# Altium schematic sheet SHEET1.SCHDOC
size A4
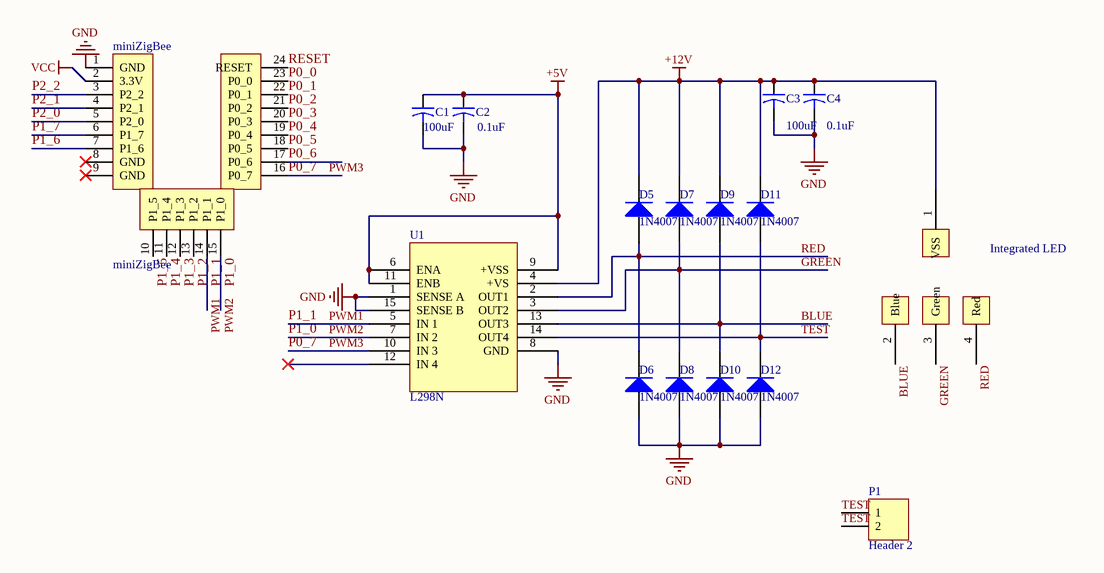
[diagram p0: SHEET1.SCHDOC]

## Parts
C1  value 100uF  [CAPR5-4X5]
C2  value 0.1uF  [CAPR5-4X5]
C3  value 100uF  [CAPR5-4X5]
C4  value 0.1uF  [CAPR5-4X5]
D5  1N4007  [DO-41]
D6  1N4007  [DO-41]
D7  1N4007  [DO-41]
D8  1N4007  [DO-41]
D9  1N4007  [DO-41]
D10  1N4007  [DO-41]
D11  1N4007  [DO-41]
D12  1N4007  [DO-41]
Integrated_LED  Integrated LED  [Integrated LED]  (value not drawn)
miniZigBee  miniZigBee  [miniZigBee]
P1  Header 2  [HDR1X2]
U1  L298N  [L298N - duplicate]

## Nets
+5V: C1.1 C2.1 U1.6(ENA) U1.9(+VSS) U1.11(ENB)
+12V: C3.1 C4.1 D5.2(K) D7.2(K) D9.2(K) D11.2(K) Integrated_LED.1(VSS) U1.4(+VS)
GND: C1.2 C2.2 C3.2 C4.2 D6.1(A) D8.1(A) D10.1(A) D12.1(A) miniZigBee.1(GND) U1.1(SENSE_A) U1.8(GND) U1.15(SENSE_B)
VCC: miniZigBee.2(3.3V)
BLUE: D9.1(A) D10.2(K) Integrated_LED.2(Blue) U1.13(OUT3)
GREEN: D7.1(A) D8.2(K) Integrated_LED.3(Green) U1.3(OUT2)
P0_0: miniZigBee.23(P0_0)
P0_1: miniZigBee.22(P0_1)
P0_2: miniZigBee.21(P0_2)
P0_3: miniZigBee.20(P0_3)
P0_4: miniZigBee.19(P0_4)
P0_5: miniZigBee.18(P0_5)
P0_6: miniZigBee.17(P0_6)
P0_7: miniZigBee.16(P0_7) U1.10(IN_3)  [also labelled PWM3]
P1_0: miniZigBee.15(P1_0) U1.7(IN_2)  [also labelled PWM2]
P1_1: miniZigBee.14(P1_1) U1.5(IN_1)  [also labelled PWM1]
P1_2: miniZigBee.13(P1_2)
P1_3: miniZigBee.12(P1_3)
P1_4: miniZigBee.11(P1_4)
P1_5: miniZigBee.10(P1_5)
P1_6: miniZigBee.7(P1_6)
P1_7: miniZigBee.6(P1_7)
P2_0: miniZigBee.5(P2_0)
P2_1: miniZigBee.4(P2_1)
P2_2: miniZigBee.3(P2_2)
RED: D5.1(A) D6.2(K) Integrated_LED.4(Red) U1.2(OUT1)
RESET: miniZigBee.24(RESET)
TEST: D11.1(A) D12.2(K) P1.1 P1.2 U1.14(OUT4)

Not connected (* = marked no-connect by the designer): miniZigBee 8(GND)* 9(GND)*; U1 12(IN_4)*

## Library data of the parts
C1-C4 = Cap2: Capacitor; Published: 23-Sep-2002; PackageReference: CAPR5-4X5; Publisher: Altium Limited
D5-D12 = Diode 1N4007: 1 Amp General Purpose Rectifier; Published: 8-Jun-2000; LatestRevisionDate: 17-Jul-2002; LatestRevisionNote: Re-released for DXP Platform.; DatasheetDocument: 1998; PackageDocument: Aug-1999; PackageReference: DO-41; Publisher: Altium Limited; Code_JEDEC: DO-204-AL; ComponentLink1Description: Manufacturer Link; ComponentLink1URL: http://www.fairchildsemi.com/; ComponentLink2Description: Datasheet; ComponentLink2URL: http://www.fairchildsemi.com/ds/1N%2F1N4001.pdf
P1 = Header 2: Header, 2-Pin; LatestRevisionDate: 17-Jul-2002; LatestRevisionNote: Re-released for DXP Platform.; Publisher: Altium Limited